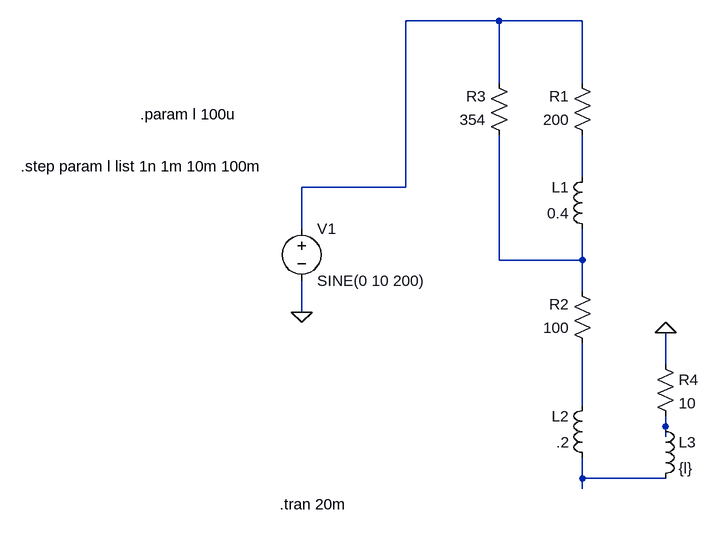
[diagram p0: schematic hummel_schaltung_blindleistung.asc]
hummel_schaltung_blindleistung.asc, the LTspice schematic file:
Version 4
SHEET 1 880 680
WIRE 80 -208 -64 -208
WIRE 208 -208 80 -208
WIRE 80 -112 80 -208
WIRE 208 -112 208 -208
WIRE 208 32 208 -32
WIRE -64 48 -64 -208
WIRE -64 48 -224 48
WIRE -224 112 -224 48
WIRE 80 160 80 -32
WIRE 208 160 208 112
WIRE 208 160 80 160
WIRE 208 208 208 160
WIRE -224 240 -224 192
WIRE 336 320 336 272
WIRE 208 384 208 288
WIRE 336 416 336 400
WIRE 336 432 336 416
WIRE 208 496 208 464
WIRE 336 496 208 496
WIRE 208 512 208 496
FLAG -224 240 0
FLAG 336 272 0
SYMBOL res 224 -16 R180
WINDOW 0 36 76 Left 0
WINDOW 3 36 40 Left 0
SYMATTR InstName R1
SYMATTR Value 200
SYMBOL res 96 -16 R180
WINDOW 0 36 76 Left 0
WINDOW 3 36 40 Left 0
SYMATTR InstName R3
SYMATTR Value 354
SYMBOL ind 224 128 R180
WINDOW 0 36 80 Left 0
WINDOW 3 36 40 Left 0
SYMATTR InstName L1
SYMATTR Value 0.4
SYMBOL res 224 304 R180
WINDOW 0 36 76 Left 0
WINDOW 3 36 40 Left 0
SYMATTR InstName R2
SYMATTR Value 100
SYMBOL ind 224 480 R180
WINDOW 0 36 80 Left 0
WINDOW 3 36 40 Left 0
SYMATTR InstName L2
SYMATTR Value .2
SYMBOL voltage -224 96 R0
WINDOW 123 0 0 Left 0
WINDOW 39 0 0 Left 0
SYMATTR InstName V1
SYMATTR Value SINE(0 10 200)
SYMBOL res 320 304 R0
SYMATTR InstName R4
SYMATTR Value 10
SYMBOL ind 320 400 R0
SYMATTR InstName L3
SYMATTR Value {l}
TEXT -258 536 Left 0 !.tran 20m
TEXT -472 -64 Left 0 !.param l 100u
TEXT -656 16 Left 0 !.step param l list 1n 1m 10m 100m

The netlist it stands for:
* hummel_schaltung_blindleistung.asc
R1 N002 N001 200
R3 N003 N001 354
L1 N003 N002 0.4
R2 N004 N003 100
L2 N006 N004 .2
V1 N001 0 SINE(0 10 200)
R4 0 N005 10
L3 N005 N006 {l}
.tran 20m
.param l 100u
.step param l list 1n 1m 10m 100m
.backanno
.end